# Altium schematic sheet Mini-Coil - Signal Board.SchDoc
size A4; SheetNumber: 1; SheetTotal: 1; SPICEModelCacheVUSYAUWE: <root> / <DocumentId>VUSYAUWE</DocumentId> / </root>
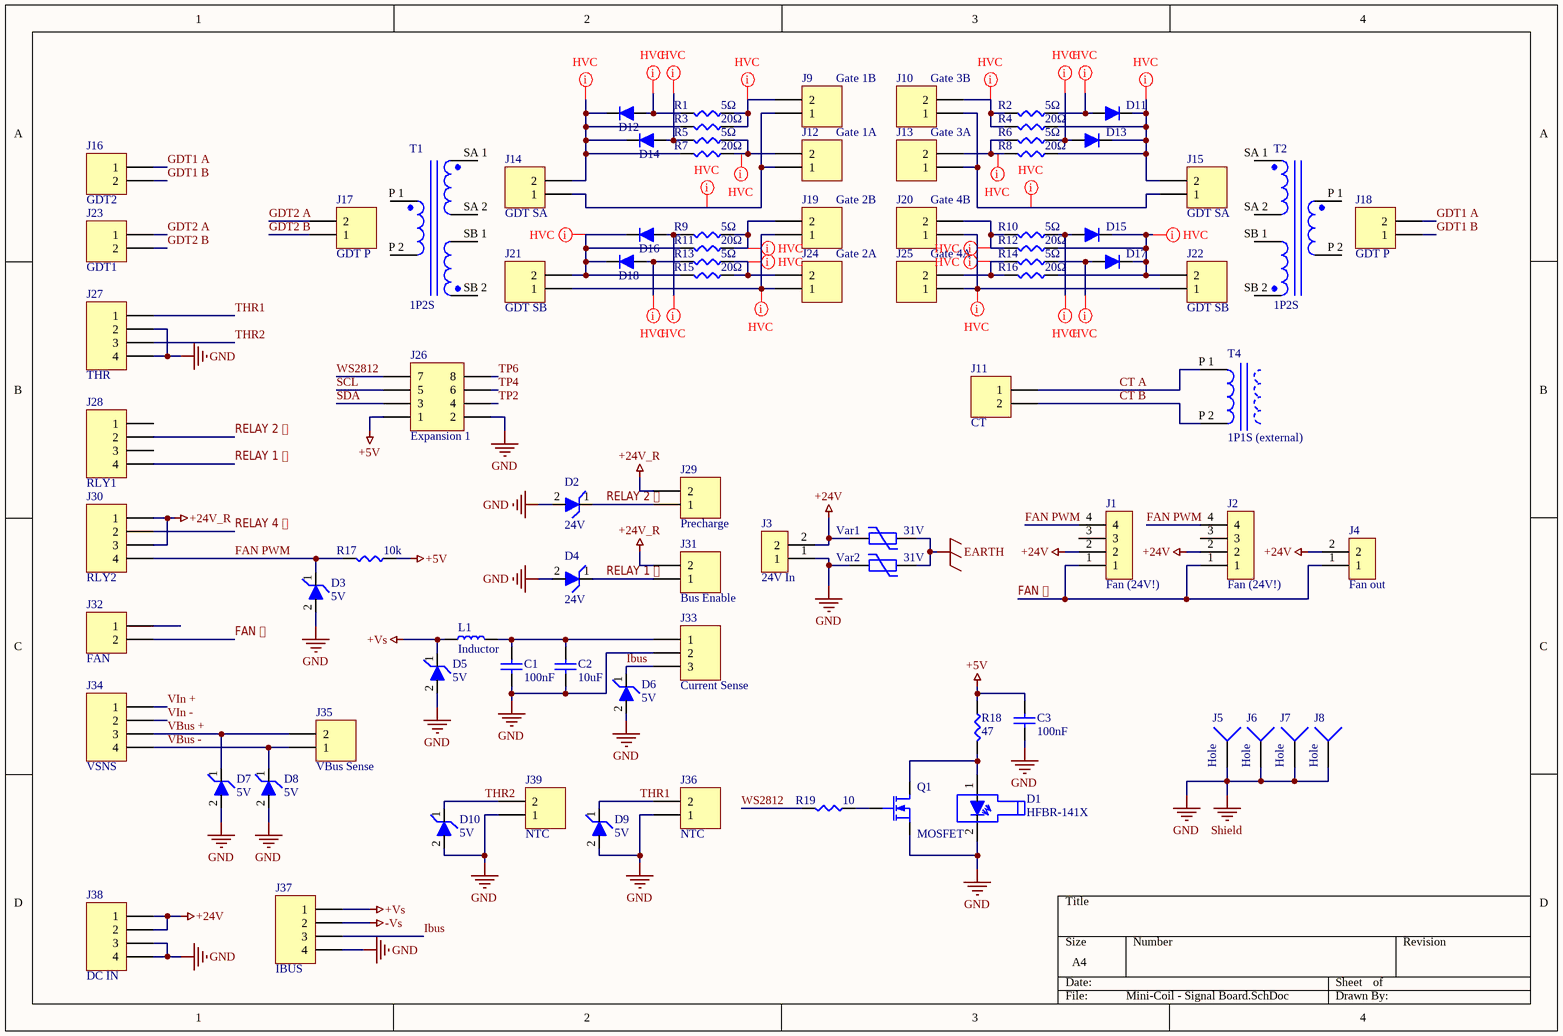
[diagram p0: Mini-Coil - Signal Board.SchDoc]

## Parts
C1  100nF  [0603]
C2  10uF  [0603]
C3  100nF  [0603]
D1  HFBR-141X  [HFBR-X5XX]
D2  24V  [DO-214]
D3  5V  [DO-214]
D4  24V  [DO-214]
D5  5V  [DO-214]
D6  5V  [DO-214]
D7  5V  [DO-214]
D8  5V  [DO-214]
D9  5V  [DO-214]
D10  5V  [DO-214]
D11  Diode  [DO-214]  (value not drawn)
D12  Diode  [DO-214]  (value not drawn)
D13  Diode  [DO-214]  (value not drawn)
D14  Diode  [DO-214]  (value not drawn)
D15  Diode  [DO-214]  (value not drawn)
D16  Diode  [DO-214]  (value not drawn)
D17  Diode  [DO-214]  (value not drawn)
D18  Diode  [DO-214]  (value not drawn)
J1  Fan (24V!)  [Fan 4Pin]
J2  Fan (24V!)  [Fan 4Pin]
J3  24V In  [2 screw terminal]
J4  Fan out  [2 screw terminal]
J5  Hole  [PIN1]
J6  Hole  [PIN1]
J7  Hole  [PIN1]
J8  Hole  [PIN1]
J9  Gate 1B  [HDR1X2]
J10  Gate 3B  [HDR1X2]
J11  CT  [HDR1X2]
J12  Gate 1A  [HDR1X2]
J13  Gate 3A  [HDR1X2]
J14  GDT SA  [2 KK254 / KF2510]
J15  GDT SA  [2 KK254 / KF2510]
J16  GDT2  [HDR1X2]
J17  GDT P  [2 KK254 / KF2510]
J18  GDT P  [2 KK254 / KF2510]
J19  Gate 2B  [HDR1X2]
J20  Gate 4B  [HDR1X2]
J21  GDT SB  [2 KK254 / KF2510]
J22  GDT SB  [2 KK254 / KF2510]
J23  GDT1  [HDR1X2]
J24  Gate 2A  [HDR1X2]
J25  Gate 4A  [HDR1X2]
J26  Expansion 1  [HDR2X4]
J27  THR  [HDR1X4]
J28  RLY1  [HDR1X4]
J29  Precharge  [HDR1X2]
J30  RLY2  [HDR1X4]
J31  Bus Enable  [HDR1X2]
J32  FAN  [HDR1X2]
J33  Current Sense  [HDR1X3]
J34  VSNS  [HDR1X4]
J35  VBus Sense  [HDR1X2]
J36  NTC  [HDR1X2]
J37  IBUS  [HDR1X4]
J38  DC IN  [HDR1X4]
J39  NTC  [HDR1X2]
L1  Inductor  [0603]
Q1  MOSFET  [sot 23]
R1  5Ω  [2512]
R2  5Ω  [2512]
R3  20Ω  [2512]
R4  20Ω  [2512]
R5  5Ω  [2512]
R6  5Ω  [2512]
R7  20Ω  [2512]
R8  20Ω  [2512]
R9  5Ω  [2512]
R10  5Ω  [2512]
R11  20Ω  [2512]
R12  20Ω  [2512]
R13  5Ω  [2512]
R14  5Ω  [2512]
R15  20Ω  [2512]
R16  20Ω  [2512]
R17  10k  [0603]
R18  47  [0603]
R19  10  [0603]
T1  1P2S  [GDT Toroidal]
T2  1P2S  [GDT Toroidal]
T4  1P1S (external)  [Current-Sense Toroid, Vertical]
Var1  31V  [Varistor disc 7mm]
Var2  31V  [Varistor disc 7mm]

## Nets
+5V: C3.2 J26.1 R17.1 R18.1
+24V: J1.2 J2.2 J3.2 J4.2 J38.1 J38.2 Var1.2
+24V_R: J29.2 J30.1 J30.3 J31.2
+Vs: D5.1 J37.1 L1.1
-Vs: J37.2
EARTH: Var1.1 Var2.1
GND: C1.1 C2.1 C3.1 D1.2 D2.2 D3.2 D4.2 D5.2 D6.2 D7.2 D8.2 D9.2 D10.2 J3.1 J5.1 J6.1 J7.1 J8.1 J26.2 J27.2 J27.4 J33.2 J36.1 J37.4 J38.3 J38.4 J39.1 Q1.S Var2.2  [also labelled Shield]
CT A: J11.1 T4.P_1
CT B: J11.2 T4.P_2
FAN PWM: D3.1 J1.4 J2.4 J30.4 R17.2
FAN ⎐: J1.1 J2.1 J4.1 J32.2
GDT1 A: J16.1 J18.2
GDT1 B: J16.2 J18.1
GDT2 A: J17.2 J23.1
GDT2 B: J17.1 J23.2
Ibus: D6.1 J33.3 J37.3
RELAY 1 ⎐: D4.1 J28.4 J31.1
RELAY 2 ⎐: D2.1 J28.2 J29.1
RELAY 4 ⎐: J30.2
SCL: J26.5
SDA: J26.3
THR1: D9.1 J27.1 J36.2
THR2: D10.1 J27.3 J39.2
TP2: J26.4
TP4: J26.6
TP6: J26.8
VBus +: D7.1 J34.3 J35.2
VBus -: D8.1 J34.4 J35.1
VIn +: J34.1
VIn -: J34.2
WS2812: J26.7 R19.2
NetC1_2: C1.2 C2.2 J33.1 L1.2
NetD1_1: D1.1 Q1.D R18.2
NetD11_1: D11.1 R2.2
NetD11_2: D11.2 D13.2 J15.2 R4.2 R8.2
NetD12_1: D12.1 R1.2
NetD12_2: D12.2 D14.2 J14.2 R3.2 R7.2
NetD13_1: D13.1 R6.2
NetD14_1: D14.1 R5.2
NetD15_1: D15.1 R10.2
NetD15_2: D15.2 D17.2 J22.2 R12.2 R16.2
NetD16_1: D16.1 R9.2
NetD16_2: D16.2 D18.2 J21.2 R11.2 R15.2
NetD17_1: D17.1 R14.2
NetD18_1: D18.1 R13.2
NetJ9_1: J9.1 J12.1 J14.1
NetJ9_2: J9.2 R1.1 R3.1
NetJ10_1: J10.1 J13.1 J15.1
NetJ10_2: J10.2 R2.1 R4.1
NetJ12_2: J12.2 R5.1 R7.1
NetJ13_2: J13.2 R6.1 R8.1
NetJ19_1: J19.1 J21.1 J24.1
NetJ19_2: J19.2 R9.1 R11.1
NetJ20_1: J20.1 J22.1 J25.1
NetJ20_2: J20.2 R10.1 R12.1
NetJ24_2: J24.2 R13.1 R15.1
NetJ25_2: J25.2 R14.1 R16.1
NetQ1_G: Q1.G R19.1

Not connected (* = marked no-connect by the designer): J1 3; J2 3; J28 1 3; J32 1; T1 P 1(7) P 2(6) SA 1(0) SA 2(1) SB 1(2) SB 2(3); T2 P 1(7) P 2(6) SA 1(0) SA 2(1) SB 1(2) SB 2(3)

## Layout directives
net class HV_G1: NetD12_1, NetD12_2, NetD14_1, NetJ9_1, NetJ9_2, NetJ12_2
net class HV_G3: NetD11_1, NetD11_2, NetD13_1, NetJ10_1, NetJ10_2, NetJ13_2
net class HV_G2: NetD16_1, NetD16_2, NetD18_1, NetJ19_1, NetJ19_2, NetJ24_2
net class HV_G4: NetD15_1, NetD15_2, NetD17_1, NetJ20_1, NetJ20_2, NetJ25_2

## Library data of the parts
C1-C3 = Cap
D1 = HFBR-15XX Transmitter: Fiber optic transmitter. Click connector; Supplier 1: Digi-Key; Supplier Part Number 1: 516-2038-ND
D2-D10 = TVS Diode: Supplier 1: Digi-Key; Supplier Part Number 1: UCLAMP3301HCT-ND
D11-D18 = Diode: Cmon its a diode what more do I need to say?; pin to pad: 1>2 2>1; Supplier 1: Digi-Key; Supplier Part Number 1: MBR10100GOS-ND; Supplier 2: Digi-Key; Supplier Part Number 2: 1655-1504-1-ND
J1 J2 = 4 header
J3 J4 = 2 screw terminal
J5-J8 = Socket: LatestRevisionDate: 17-Jul-2002; LatestRevisionNote: Re-released for DXP Platform.; Publisher: Altium Limited
J9-J25 J29 J31 J32 J35 J36 J39 = Header 2: Header, 2-Pin; LatestRevisionDate: 17-Jul-2002; LatestRevisionNote: Re-released for DXP Platform.; Publisher: Altium Limited
J26 = Header 4X2: Header, 4-Pin, Dual row; LatestRevisionDate: 17-Jul-2002; LatestRevisionNote: Re-released for DXP Platform.; Publisher: Altium Limited
J27 J28 J30 J34 J37 J38 = Header 4: Header, 4-Pin; LatestRevisionDate: 17-Jul-2002; LatestRevisionNote: Re-released for DXP Platform.; Publisher: Altium Limited
J33 = Header 3: Header, 3-Pin; LatestRevisionDate: 17-Jul-2002; LatestRevisionNote: Re-released for DXP Platform.; Publisher: Altium Limited
Q1 = Mosfet N: pin to pad: D>3 G>1 S>2; Supplier 1: Digi-Key; Supplier Part Number 1: 1727-5305-1-ND; Supplier 2: Digi-Key; Supplier Part Number 2: 1727-1123-1-ND; Supplier 3: Digi-Key; Supplier 4: Digi-Key; Supplier Part Number 4: T2N7002AKLMCT-ND; Supplier Part Number 3: BSC0906NSATMA1CT-ND; Supplier 5: Digi-Key; Supplier Part Number 5: 1727-4714-1-ND; Supplier 6: Digi-Key; Supplier 7: Digi-Key; Supplier Part Number 6: 497-14572-5-ND; Supplier Part Number 7: IPP180N10N3GXKSA1-ND
R1-R19 = Resistor
T1 T2 = 1P2S: pin to pad: P 1>1 P 2>2 SA 1>6 SA 2>5 SB 1>4 SB 2>3
T4 = 1P1S (external): Transformer with Secondary winding connected externally; pin to pad: P 1>1 P 2>2
Var1 Var2 = Varistor: Varistor, he protecc
L1 = Inductor: Supplier 1: Digi-Key; Supplier 2: Digi-Key; Supplier Part Number 1: 541-1250-1-ND; Supplier Part Number 2: 541-1253-1-ND; Supplier 3: Digi-Key; Supplier 4: Digi-Key; Supplier Part Number 3: SRN6028-3R9MCT-ND; Supplier Part Number 4: SRN6028-4R7MCT-ND; Supplier 5: Digi-Key; Supplier Part Number 5: 490-10563-1-ND; Supplier 6: Digi-Key; Supplier 7: Digi-Key; Supplier 8: Digi-Key; Supplier 9: Digi-Key; Supplier Part Number 6: 1276-6932-1-ND; Supplier Part Number 7: 587-2042-1-ND; Supplier Part Number 9: SRP1265A-1R0MCT-ND; Supplier Part Number 8: 535-12790-1-ND; Supplier 10: Digi-Key; Supplier Part Number 10: SRP1770TA-5R6MCT-ND; Supplier 11: Digi-Key; Supplier Part Number 11: SRN6028-100MCT-ND; Supplier 12: Digi-Key; Supplier Part Number 12: SRN2510F-2R2MCT-ND; Supplier 13: Digi-Key; Supplier Part Number 13: 490-3992-1-ND